# EAGLE schematic 3dofboard (EAGLE 6.5.0)
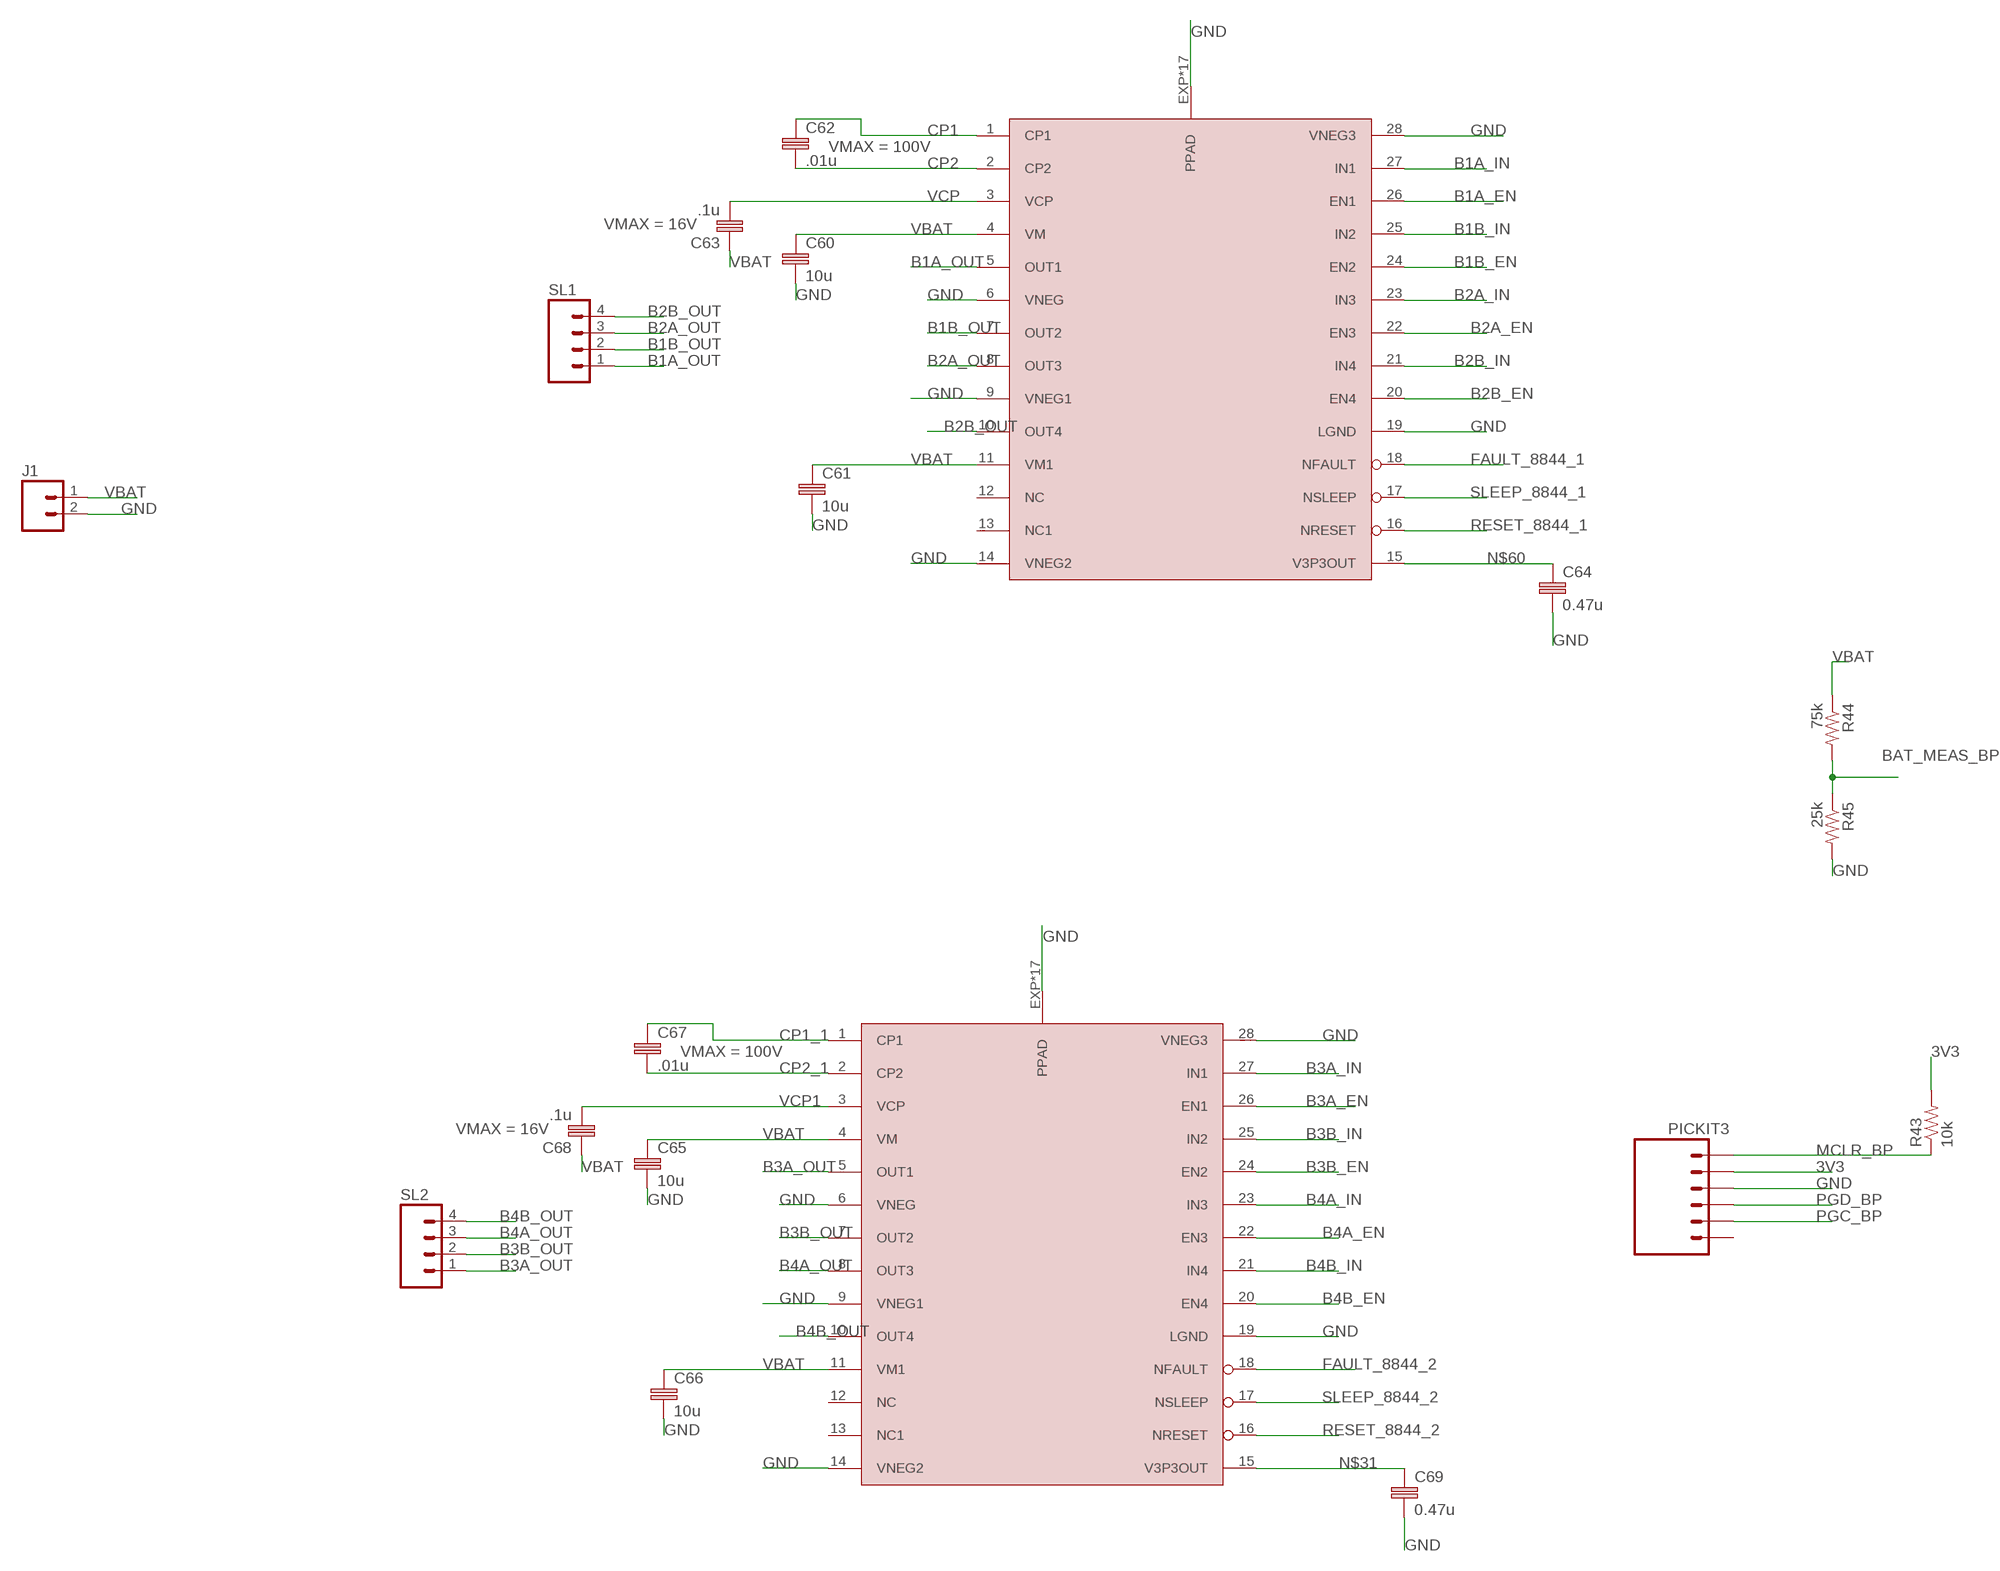
[diagram p0: schematic, sheet 1, part 1 of 3]
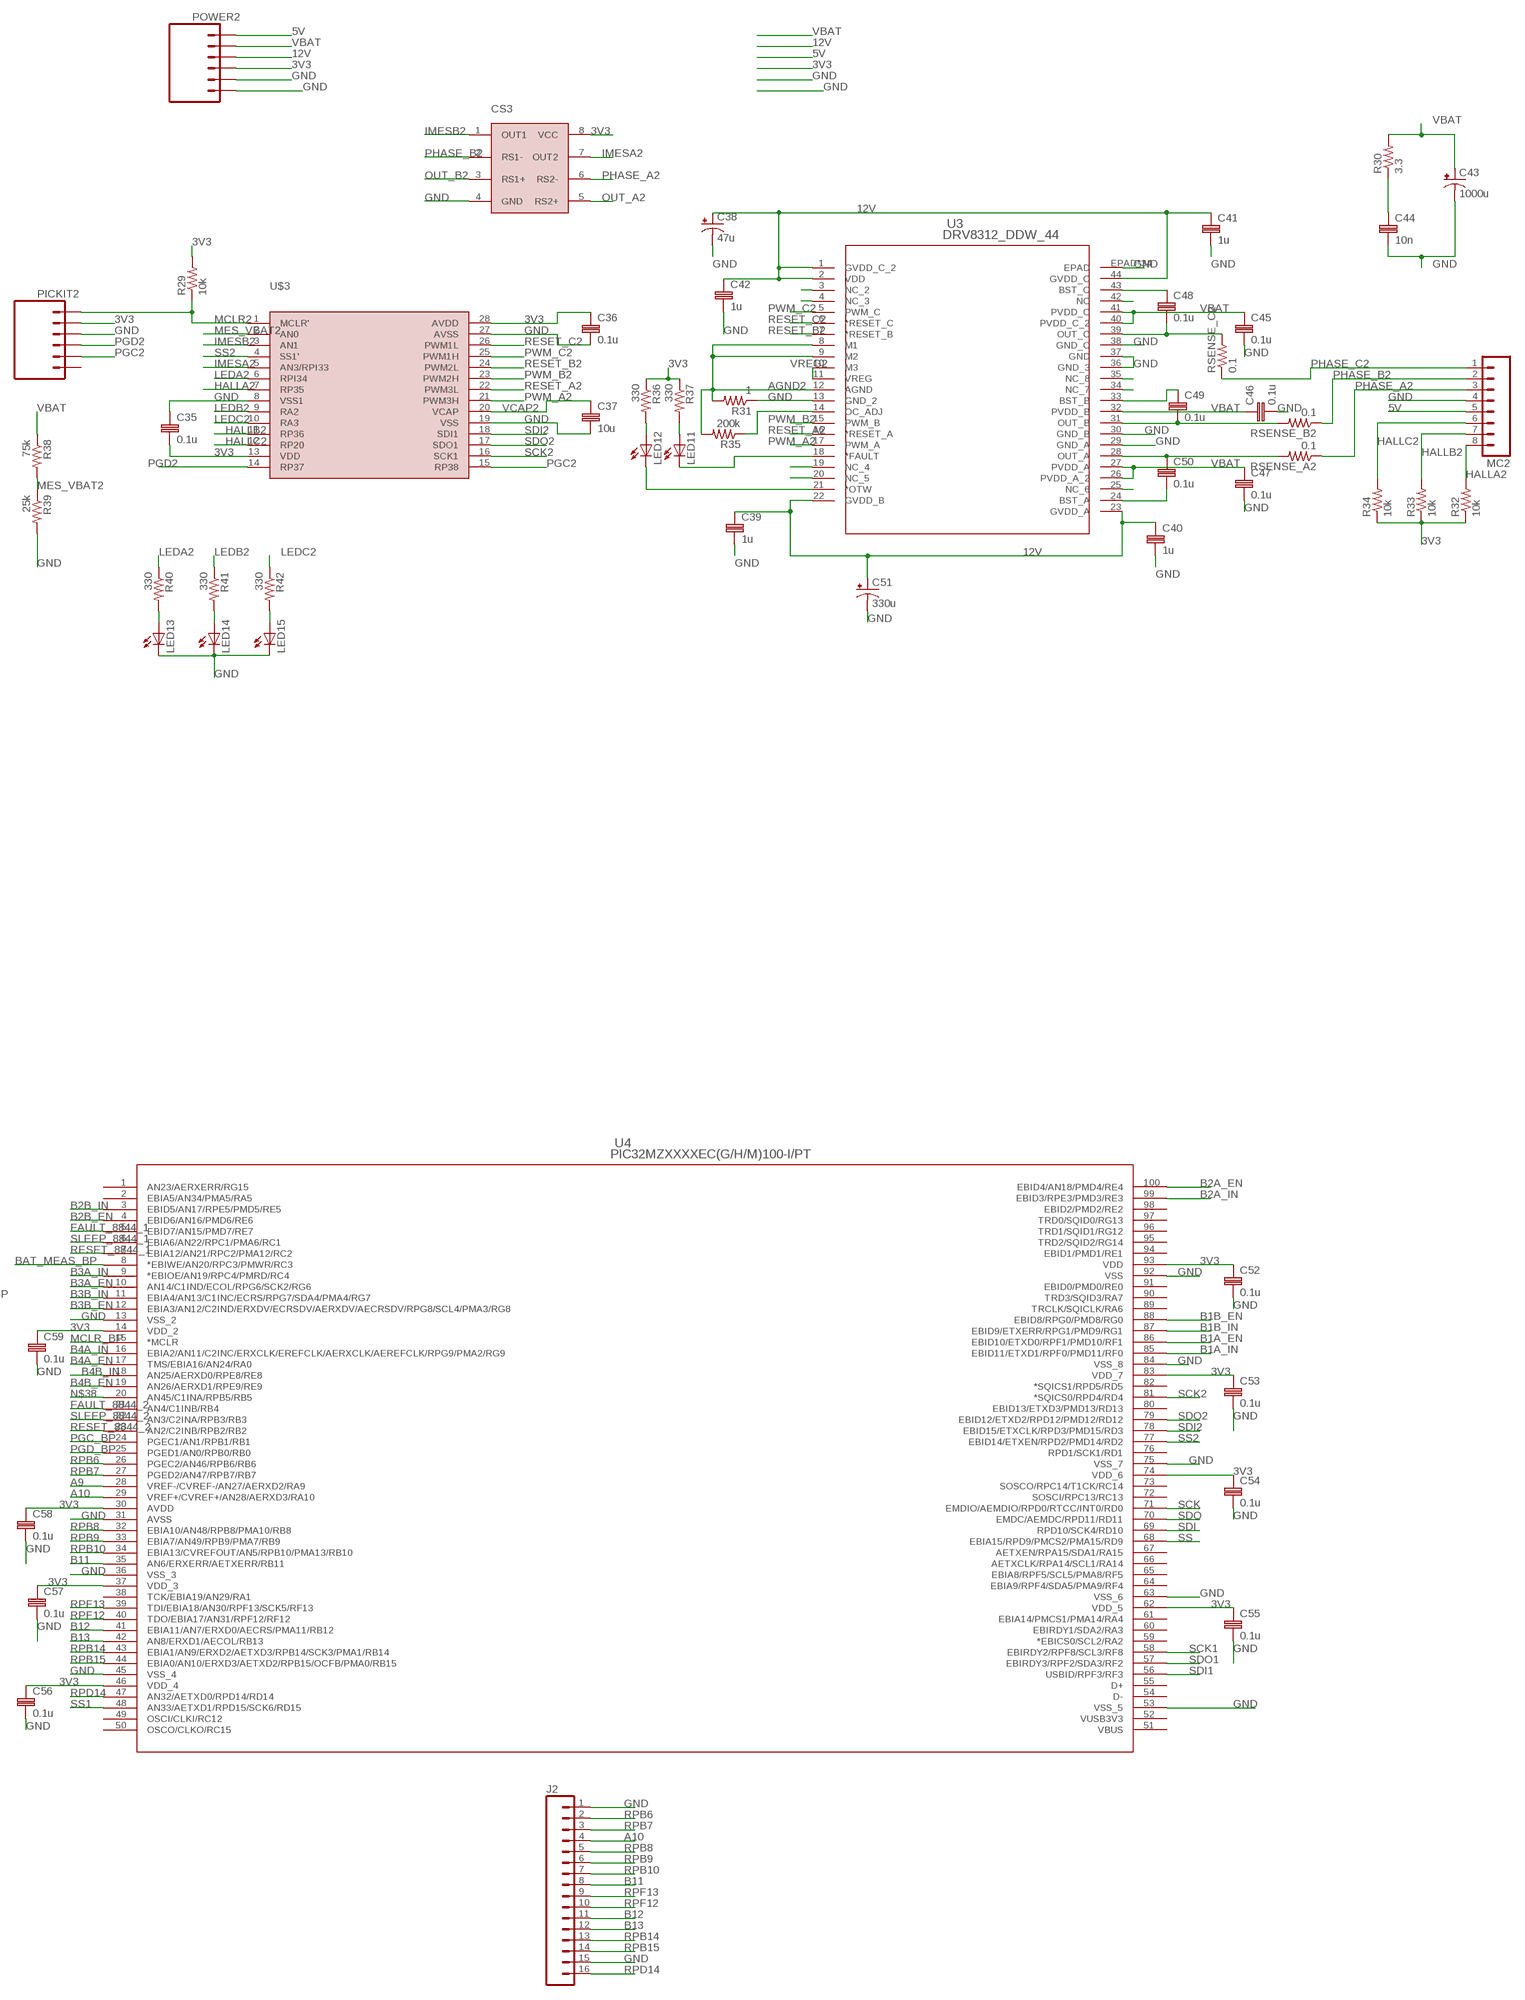
[diagram p1: schematic, sheet 1, part 2 of 3]
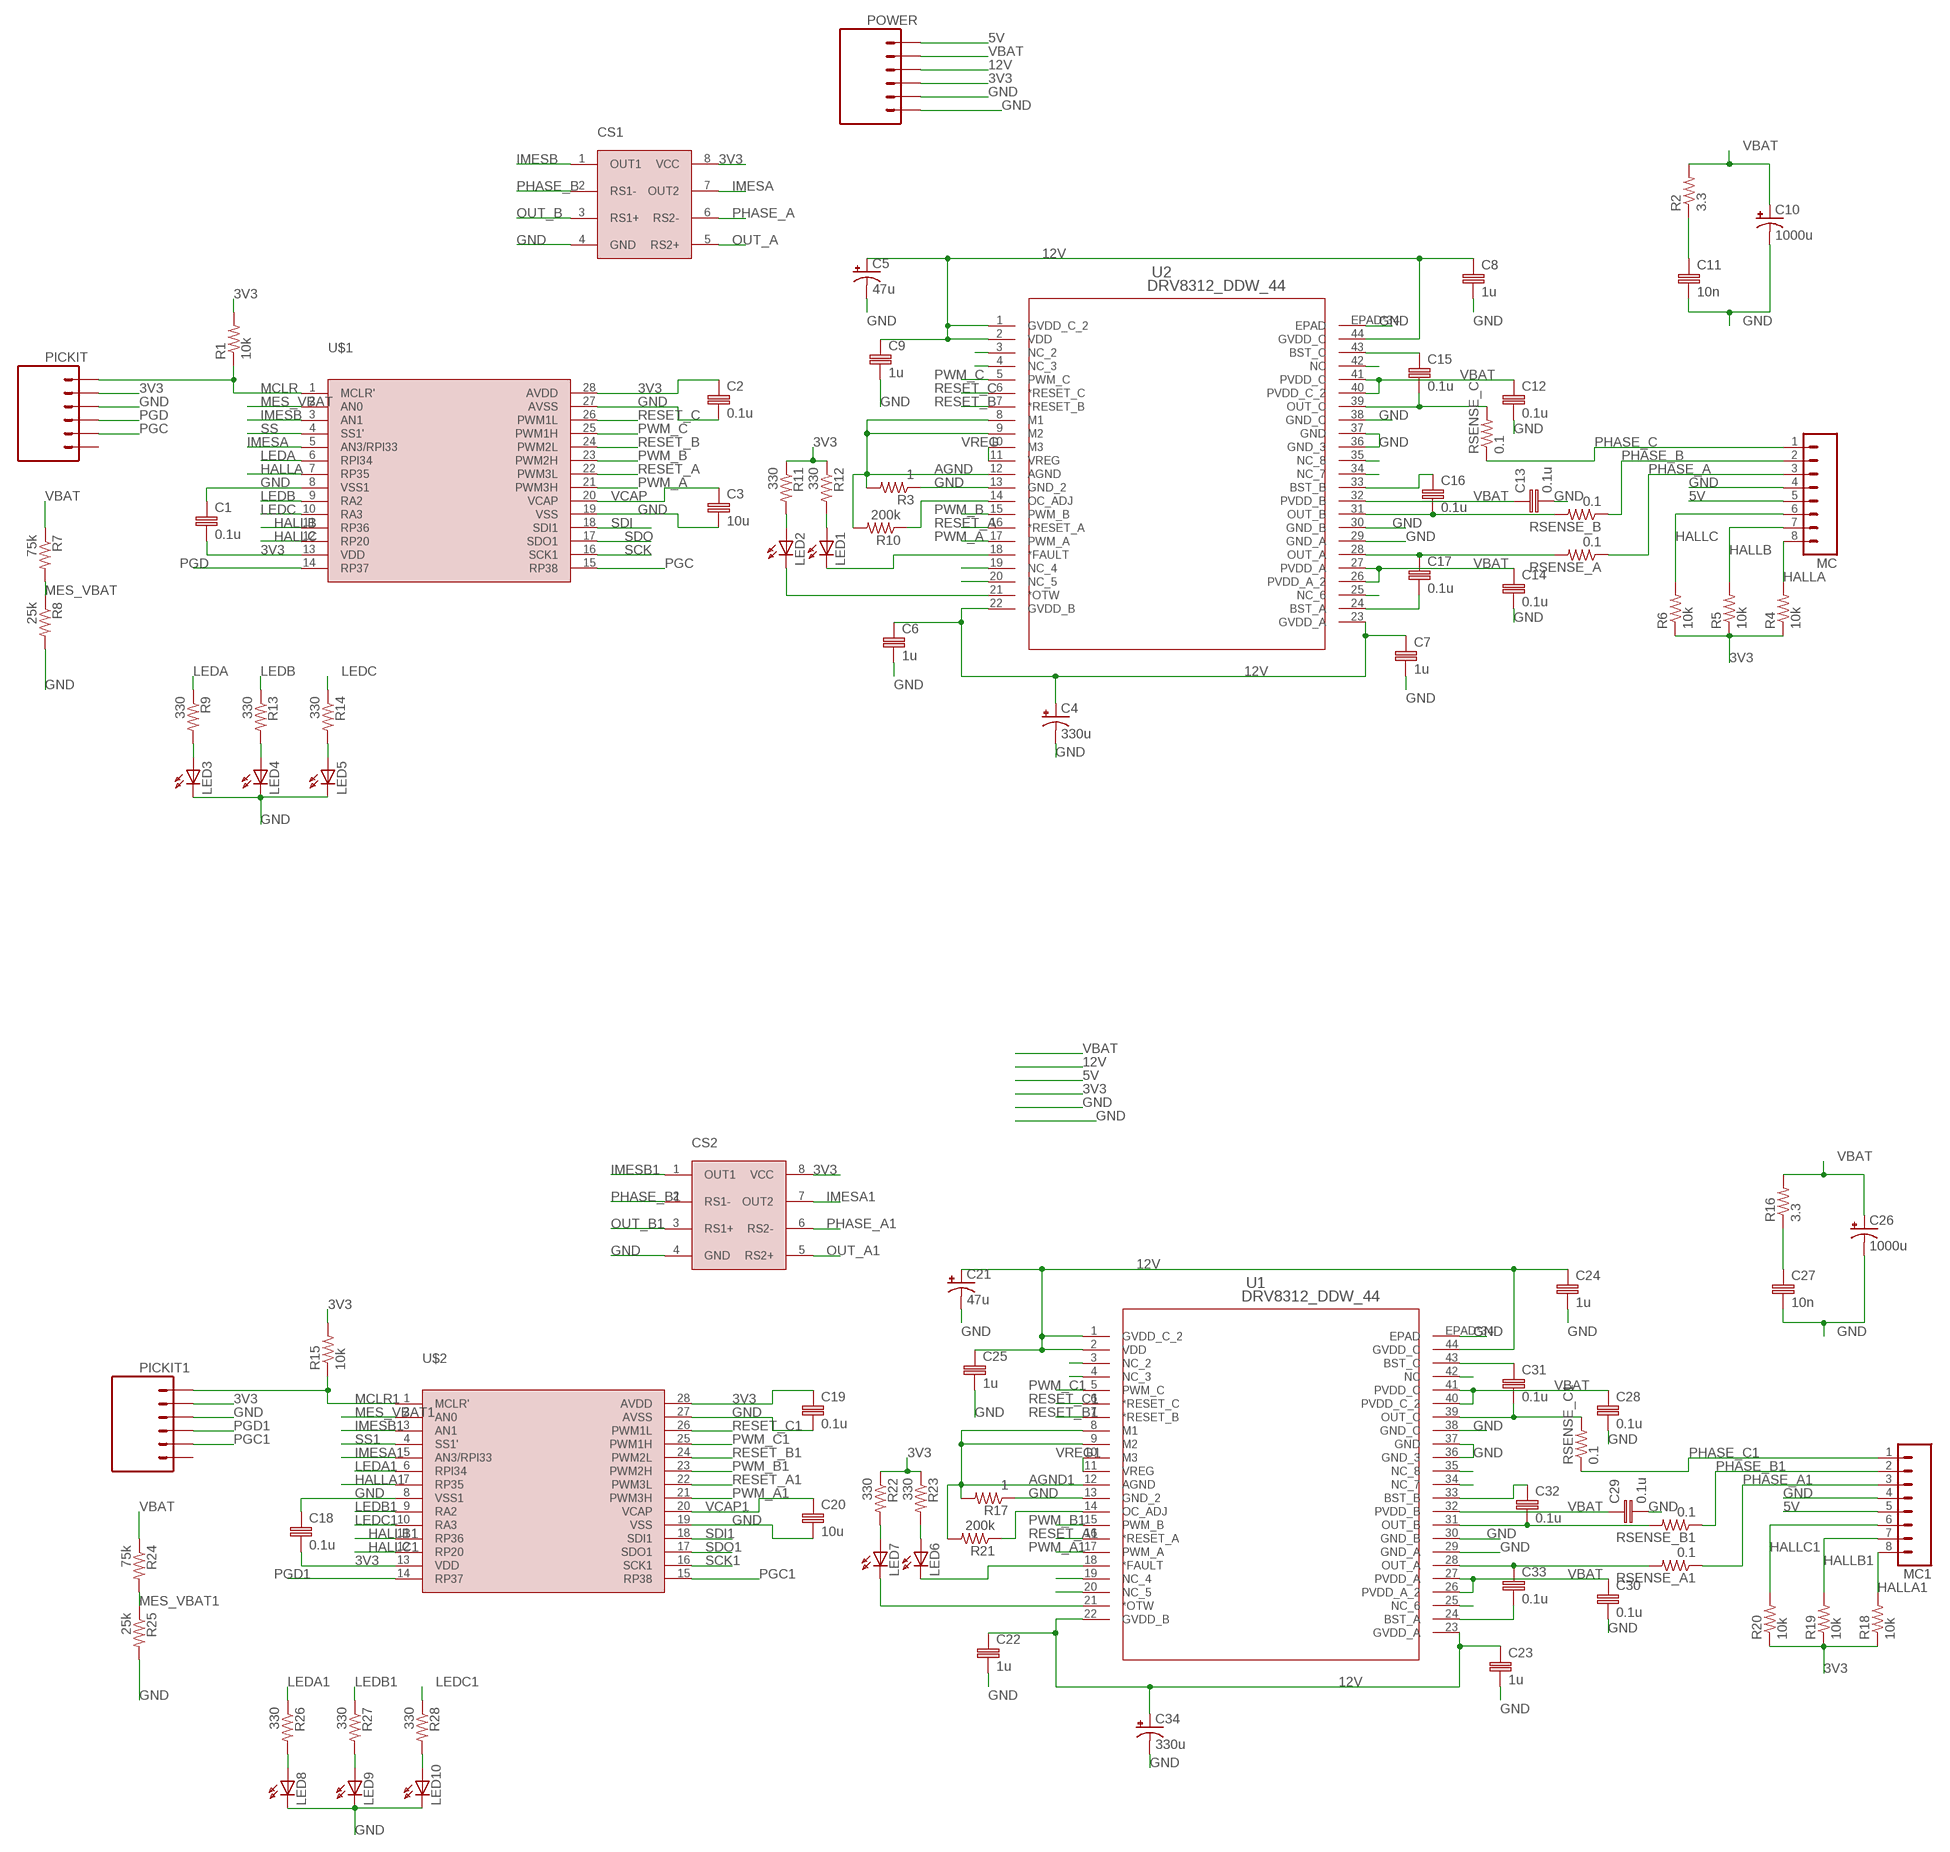
[diagram p2: schematic, sheet 1, part 3 of 3]

## Parts
C1  0.1u  CAP0805  [0805]
C2  0.1u  CAP0805  [0805]
C3  10u  CAP0805  [0805]
C4  330u  CPOL-USE3.5-8  [E3,5-8]
C5  47u  CAP_POLPTH1  [CPOL-RADIAL-100UF-25V]
C6  1u  CAP0805  [0805]
C7  1u  CAP0805  [0805]
C8  1u  CAP0805  [0805]
C9  1u  CAP0805  [0805]
C10  1000u  CAP_POLPTH4  [CPOL-RADIAL-1000UF-25V]
C11  10n  CAP0805  [0805]
C12  0.1u  CAP0805  [0805]
C13  0.1u  CAP0805  [0805]
C14  0.1u  CAP0805  [0805]
C15  0.1u  CAP0805  [0805]
C16  0.1u  CAP0805  [0805]
C17  0.1u  CAP0805  [0805]
C18  0.1u  CAP0805  [0805]
C19  0.1u  CAP0805  [0805]
C20  10u  CAP0805  [0805]
C21  47u  CAP_POLPTH1  [CPOL-RADIAL-100UF-25V]
C22  1u  CAP0805  [0805]
C23  1u  CAP0805  [0805]
C24  1u  CAP0805  [0805]
C25  1u  CAP0805  [0805]
C26  1000u  CAP_POLPTH4  [CPOL-RADIAL-1000UF-25V]
C27  10n  CAP0805  [0805]
C28  0.1u  CAP0805  [0805]
C29  0.1u  CAP0805  [0805]
C30  0.1u  CAP0805  [0805]
C31  0.1u  CAP0805  [0805]
C32  0.1u  CAP0805  [0805]
C33  0.1u  CAP0805  [0805]
C34  330u  CPOL-USE3.5-8  [E3,5-8]
C35  0.1u  CAP0805  [0805]
C36  0.1u  CAP0805  [0805]
C37  10u  CAP0805  [0805]
C38  47u  CAP_POLPTH1  [CPOL-RADIAL-100UF-25V]
C39  1u  CAP0805  [0805]
C40  1u  CAP0805  [0805]
C41  1u  CAP0805  [0805]
C42  1u  CAP0805  [0805]
C43  1000u  CAP_POLPTH4  [CPOL-RADIAL-1000UF-25V]
C44  10n  CAP0805  [0805]
C45  0.1u  CAP0805  [0805]
C46  0.1u  CAP0805  [0805]
C47  0.1u  CAP0805  [0805]
C48  0.1u  CAP0805  [0805]
C49  0.1u  CAP0805  [0805]
C50  0.1u  CAP0805  [0805]
C51  330u  CPOL-USE3.5-8  [E3,5-8]
C52  0.1u  CAP0805  [0805]
C53  0.1u  CAP0805  [0805]
C54  0.1u  CAP0805  [0805]
C55  0.1u  CAP0805  [0805]
C56  0.1u  CAP0805  [0805]
C57  0.1u  CAP0805  [0805]
C58  0.1u  CAP0805  [0805]
C59  0.1u  CAP0805  [0805]
C60  10u  CAP0805  [0805]
C61  10u  CAP0805  [0805]
C62  .01u  CAP0805  [0805]
C63  .1u  CAP0805  [0805]
C64  0.47u  CAP0805  [0805]
C65  10u  CAP0805  [0805]
C66  10u  CAP0805  [0805]
C67  .01u  CAP0805  [0805]
C68  .1u  CAP0805  [0805]
C69  0.47u  CAP0805  [0805]
CS1  MAX4376  [SO8]
CS2  MAX4376  [SO8]
CS3  MAX4376  [SO8]
J1  M02LOCK  [1X02_LOCK]
J2  M16DUAL_ROW  [2X8]
LED1  LED0805  [LED-0805]
LED2  LED0805  [LED-0805]
LED3  LED0805  [LED-0805]
LED4  LED0805  [LED-0805]
LED5  LED0805  [LED-0805]
LED6  LED0805  [LED-0805]
LED7  LED0805  [LED-0805]
LED8  LED0805  [LED-0805]
LED9  LED0805  [LED-0805]
LED10  LED0805  [LED-0805]
LED11  LED0805  [LED-0805]
LED12  LED0805  [LED-0805]
LED13  LED0805  [LED-0805]
LED14  LED0805  [LED-0805]
LED15  LED0805  [LED-0805]
MC  M08  [08P]
MC1  M08  [08P]
MC2  M08  [08P]
PICKIT  M06LOCK  [1X06_LOCK]
PICKIT1  M06LOCK  [1X06_LOCK]
PICKIT2  M06LOCK  [1X06_LOCK]
PICKIT3  M06LOCK  [1X06_LOCK]
POWER  M06LOCK  [1X06_LOCK]
POWER2  M06LOCK  [1X06_LOCK]
R1  10k  RESISTOR0805-RES  [0805]
R2  3.3  RESISTOR0805-RES  [0805]
R3  1  RESISTOR0805-RES  [0805]
R4  10k  RESISTOR0805-RES  [0805]
R5  10k  RESISTOR0805-RES  [0805]
R6  10k  RESISTOR0805-RES  [0805]
R7  75k  RESISTOR0805-RES  [0805]
R8  25k  RESISTOR0805-RES  [0805]
R9  330  RESISTOR0805-RES  [0805]
R10  200k  RESISTOR0805-RES  [0805]
R11  330  RESISTOR0805-RES  [0805]
R12  330  RESISTOR0805-RES  [0805]
R13  330  RESISTOR0805-RES  [0805]
R14  330  RESISTOR0805-RES  [0805]
R15  10k  RESISTOR0805-RES  [0805]
R16  3.3  RESISTOR0805-RES  [0805]
R17  1  RESISTOR0805-RES  [0805]
R18  10k  RESISTOR0805-RES  [0805]
R19  10k  RESISTOR0805-RES  [0805]
R20  10k  RESISTOR0805-RES  [0805]
R21  200k  RESISTOR0805-RES  [0805]
R22  330  RESISTOR0805-RES  [0805]
R23  330  RESISTOR0805-RES  [0805]
R24  75k  RESISTOR0805-RES  [0805]
R25  25k  RESISTOR0805-RES  [0805]
R26  330  RESISTOR0805-RES  [0805]
R27  330  RESISTOR0805-RES  [0805]
R28  330  RESISTOR0805-RES  [0805]
R29  10k  RESISTOR0805-RES  [0805]
R30  3.3  RESISTOR0805-RES  [0805]
R31  1  RESISTOR0805-RES  [0805]
R32  10k  RESISTOR0805-RES  [0805]
R33  10k  RESISTOR0805-RES  [0805]
R34  10k  RESISTOR0805-RES  [0805]
R35  200k  RESISTOR0805-RES  [0805]
R36  330  RESISTOR0805-RES  [0805]
R37  330  RESISTOR0805-RES  [0805]
R38  75k  RESISTOR0805-RES  [0805]
R39  25k  RESISTOR0805-RES  [0805]
R40  330  RESISTOR0805-RES  [0805]
R41  330  RESISTOR0805-RES  [0805]
R42  330  RESISTOR0805-RES  [0805]
R43  10k  RESISTOR0805-RES  [0805]
R44  75k  RESISTOR0805-RES  [0805]
R45  25k  RESISTOR0805-RES  [0805]
RSENSE_A  0.1  RESISTOR0805-RES  [0805]
RSENSE_A1  0.1  RESISTOR0805-RES  [0805]
RSENSE_A2  0.1  RESISTOR0805-RES  [0805]
RSENSE_B  0.1  RESISTOR0805-RES  [0805]
RSENSE_B1  0.1  RESISTOR0805-RES  [0805]
RSENSE_B2  0.1  RESISTOR0805-RES  [0805]
RSENSE_C  0.1  RESISTOR0805-RES  [0805]
RSENSE_C1  0.1  RESISTOR0805-RES  [0805]
RSENSE_C2  0.1  RESISTOR0805-RES  [0805]
SL1  M04LOCK  [1X04_LOCK]
SL2  M04LOCK  [1X04_LOCK]
U1  DRV8312_DDW_44  [DDW44_8P26X4P31]
U2  DRV8312_DDW_44  [DDW44_8P26X4P31]
U3  DRV8312_DDW_44  [DDW44_8P26X4P31]
U4  PIC32MZXXXXEC(G/H/M)100-I/PT  [TQFP100_12X12MC]
U$1  DSPIC33EP512MC502-28SSOP  [SSOP28]
U$2  DSPIC33EP512MC502-28SSOP  [SSOP28]
U$3  DSPIC33EP512MC502-28SSOP  [SSOP28]
U$4  DRV8844PWP  [TSSOP-28]
U$5  DRV8844PWP  [TSSOP-28]

## Nets
3V3: C1.2 C2.1 C18.2 C19.1 C35.2 C36.1 C52.1 C53.1 C54.1 C55.1 C56.1 C57.1 C58.1 C59.1 CS1.8(VCC) CS2.8(VCC) CS3.8(VCC) PICKIT1.2 PICKIT2.2 PICKIT3.2 PICKIT.2 POWER2.4 POWER.4 R1.2 R4.1 R5.1 R6.1 R11.1 R12.1 R15.2 R18.1 R19.1 R20.1 R22.1 R23.1 R29.2 R32.1 R33.1 R34.1 R36.1 R37.1 R43.2 U4.14(VDD_2) U4.30(AVDD) U4.37(VDD_3) U4.46(VDD_4) U4.62(VDD_5) U4.74(VDD_6) U4.83(VDD_7) U4.93(VDD) U$1.13(VDD) U$1.28(AVDD) U$2.13(VDD) U$2.28(AVDD) U$3.13(VDD) U$3.28(AVDD)
5V: MC1.5 MC2.5 MC.5 POWER2.1 POWER.1
12V: C4.+ C5.1(+) C6.1 C7.1 C8.1 C9.1 C21.1(+) C22.1 C23.1 C24.1 C25.1 C34.+ C38.1(+) C39.1 C40.1 C41.1 C42.1 C51.+ POWER2.3 POWER.3 U1.1(GVDD_C_2) U1.2(VDD) U1.22(GVDD_B) U1.23(GVDD_A) U1.44(GVDD_C) U2.1(GVDD_C_2) U2.2(VDD) U2.22(GVDD_B) U2.23(GVDD_A) U2.44(GVDD_C) U3.1(GVDD_C_2) U3.2(VDD) U3.22(GVDD_B) U3.23(GVDD_A) U3.44(GVDD_C)
A9: U4.28(VREF-/CVREF-/AN27/AERXD2/RA9)
A10: J2.4 U4.29(VREF+/CVREF+/AN28/AERXD3/RA10)
AGND: R3.2 R10.2 U2.8(M1) U2.9(M2) U2.12(AGND)
AGND1: R17.2 R21.2 U1.8(M1) U1.9(M2) U1.12(AGND)
AGND2: R31.2 R35.2 U3.8(M1) U3.9(M2) U3.12(AGND)
B1A_EN: U4.86(EBID10/ETXD0/RPF1/PMD10/RF1) U$4.26(EN1)
B1A_IN: U4.85(EBID11/ETXD1/RPF0/PMD11/RF0) U$4.27(IN1)
B1A_OUT: SL1.1 U$4.5(OUT1)
B1B_EN: U4.88(EBID8/RPG0/PMD8/RG0) U$4.24(EN2)
B1B_IN: U4.87(EBID9/ETXERR/RPG1/PMD9/RG1) U$4.25(IN2)
B1B_OUT: SL1.2 U$4.7(OUT2)
B2A_EN: U4.100(EBID4/AN18/PMD4/RE4) U$4.22(EN3)
B2A_IN: U4.99(EBID3/RPE3/PMD3/RE3) U$4.23(IN3)
B2A_OUT: SL1.3 U$4.8(OUT3)
B2B_EN: U4.4(EBID6/AN16/PMD6/RE6) U$4.20(EN4)
B2B_IN: U4.3(EBID5/AN17/RPE5/PMD5/RE5) U$4.21(IN4)
B2B_OUT: SL1.4 U$4.10(OUT4)
B3A_EN: U4.10(AN14/C1IND/ECOL/RPG6/SCK2/RG6) U$5.26(EN1)
B3A_IN: U4.9(*EBIOE/AN19/RPC4/PMRD/RC4) U$5.27(IN1)
B3A_OUT: SL2.1 U$5.5(OUT1)
B3B_EN: U4.12(EBIA3/AN12/C2IND/ERXDV/ECRSDV/AERXDV/AECRSDV/RPG8/SCL4/PMA3/RG8) U$5.24(EN2)
B3B_IN: U4.11(EBIA4/AN13/C1INC/ECRS/RPG7/SDA4/PMA4/RG7) U$5.25(IN2)
B3B_OUT: SL2.2 U$5.7(OUT2)
B4A_EN: U4.17(TMS/EBIA16/AN24/RA0) U$5.22(EN3)
B4A_IN: U4.16(EBIA2/AN11/C2INC/ERXCLK/EREFCLK/AERXCLK/AEREFCLK/RPG9/PMA2/RG9) U$5.23(IN3)
B4A_OUT: SL2.3 U$5.8(OUT3)
B4B_EN: U4.19(AN26/AERXD1/RPE9/RE9) U$5.20(EN4)
B4B_IN: U4.18(AN25/AERXD0/RPE8/RE8) U$5.21(IN4)
B4B_OUT: SL2.4 U$5.10(OUT4)
B11: J2.8 U4.35(AN6/ERXERR/AETXERR/RB11)
B12: J2.11 U4.41(EBIA11/AN7/ERXD0/AECRS/PMA11/RB12)
B13: J2.12 U4.42(AN8/ERXD1/AECOL/RB13)
BAT_MEAS_BP: R44.2 R45.1 U4.8(*EBIWE/AN20/RPC3/PMWR/RC3)
CP1: C62.1 U$4.1(CP1)
CP1_1: C67.1 U$5.1(CP1)
CP2: C62.2 U$4.2(CP2)
CP2_1: C67.2 U$5.2(CP2)
FAULT': LED1.2(C) U2.18(*FAULT)
FAULT'1: LED6.2(C) U1.18(*FAULT)
FAULT'2: LED11.2(C) U3.18(*FAULT)
FAULT_8844_1: U4.5(EBID7/AN15/PMD7/RE7) U$4.18(NFAULT)
FAULT_8844_2: U4.21(AN4/C1INB/RB4) U$5.18(NFAULT)
GND: C1.1 C2.2 C3.2 C4.- C5.2(-) C6.2 C7.2 C8.2 C9.2 C10.2(-) C11.2 C12.2 C13.2 C14.2 C18.1 C19.2 C20.2 C21.2(-) C22.2 C23.2 C24.2 C25.2 C26.2(-) C27.2 C28.2 C29.2 C30.2 C34.- C35.1 C36.2 C37.2 C38.2(-) C39.2 C40.2 C41.2 C42.2 C43.2(-) C44.2 C45.2 C46.2 C47.2 C51.- C52.2 C53.2 C54.2 C55.2 C56.2 C57.2 C58.2 C59.2 C60.2 C61.2 C64.2 C65.2 C66.2 C69.2 CS1.4(GND) CS2.4(GND) CS3.4(GND) J1.2 J2.1 J2.15 LED3.2(C) LED4.2(C) LED5.2(C) LED8.2(C) LED9.2(C) LED10.2(C) LED13.2(C) LED14.2(C) LED15.2(C) MC1.4 MC2.4 MC.4 PICKIT1.3 PICKIT2.3 PICKIT3.3 PICKIT.3 POWER2.5 POWER2.6 POWER.5 POWER.6 R3.1 R8.2 R17.1 R25.2 R31.1 R39.2 R45.2 U1.3(NC_2) U1.4(NC_3) U1.13(GND_2) U1.19(NC_4) U1.20(NC_5) U1.25(NC_6) U1.29(GND_A) U1.30(GND_B) U1.34(NC_7) U1.35(NC_8) U1.36(GND_3) U1.37(GND) U1.38(GND_C) U1.42(NC) U1.EPAD U1.P$1(EPAD) U1.P$2(EPAD) U1.P$3(EPAD) U1.P$4(EPAD) U1.P$5(EPAD) U1.P$6(EPAD) U1.P$7(EPAD) U1.P$8(EPAD) U1.P$9(EPAD) U1.P$10(EPAD) U1.P$11(EPAD) U1.P$12(EPAD) U1.P$13(EPAD) U1.P$14(EPAD) U1.P$15(EPAD) U1.P$16(EPAD) U1.P$17(EPAD) U1.P$18(EPAD) U1.P$19(EPAD) U1.P$20(EPAD) U1.P$21(EPAD) U1.P$22(EPAD) U1.P$23(EPAD) U1.P$24(EPAD) U1.P$25(EPAD) U1.P$26(EPAD) U1.P$27(EPAD) U1.P$28(EPAD) U1.P$29(EPAD) U1.P$30(EPAD) U1.P$31(EPAD) U1.P$32(EPAD) U1.P$33(EPAD) U2.3(NC_2) U2.4(NC_3) U2.13(GND_2) U2.19(NC_4) U2.20(NC_5) U2.25(NC_6) U2.29(GND_A) U2.30(GND_B) U2.34(NC_7) U2.35(NC_8) U2.36(GND_3) U2.37(GND) U2.38(GND_C) U2.42(NC) U2.EPAD U2.P$1(EPAD) U2.P$2(EPAD) U2.P$3(EPAD) U2.P$4(EPAD) U2.P$5(EPAD) U2.P$6(EPAD) U2.P$7(EPAD) U2.P$8(EPAD) U2.P$9(EPAD) U2.P$10(EPAD) U2.P$11(EPAD) U2.P$12(EPAD) U2.P$13(EPAD) U2.P$14(EPAD) U2.P$15(EPAD) U2.P$16(EPAD) U2.P$17(EPAD) U2.P$18(EPAD) U2.P$19(EPAD) U2.P$20(EPAD) U2.P$21(EPAD) U2.P$22(EPAD) U2.P$23(EPAD) U2.P$24(EPAD) U2.P$25(EPAD) U2.P$26(EPAD) U2.P$27(EPAD) U2.P$28(EPAD) U2.P$29(EPAD) U2.P$30(EPAD) U2.P$31(EPAD) U2.P$32(EPAD) U2.P$33(EPAD) U3.3(NC_2) U3.4(NC_3) U3.13(GND_2) U3.19(NC_4) U3.20(NC_5) U3.25(NC_6) U3.29(GND_A) U3.30(GND_B) U3.34(NC_7) U3.35(NC_8) U3.36(GND_3) U3.37(GND) U3.38(GND_C) U3.42(NC) U3.EPAD U3.P$1(EPAD) U3.P$2(EPAD) U3.P$3(EPAD) U3.P$4(EPAD) U3.P$5(EPAD) U3.P$6(EPAD) U3.P$7(EPAD) U3.P$8(EPAD) U3.P$9(EPAD) U3.P$10(EPAD) U3.P$11(EPAD) U3.P$12(EPAD) U3.P$13(EPAD) U3.P$14(EPAD) U3.P$15(EPAD) U3.P$16(EPAD) U3.P$17(EPAD) U3.P$18(EPAD) U3.P$19(EPAD) U3.P$20(EPAD) U3.P$21(EPAD) U3.P$22(EPAD) U3.P$23(EPAD) U3.P$24(EPAD) U3.P$25(EPAD) U3.P$26(EPAD) U3.P$27(EPAD) U3.P$28(EPAD) U3.P$29(EPAD) U3.P$30(EPAD) U3.P$31(EPAD) U3.P$32(EPAD) U3.P$33(EPAD) U4.13(VSS_2) U4.31(AVSS) U4.36(VSS_3) U4.45(VSS_4) U4.53(VSS_5) U4.63(VSS_6) U4.75(VSS_7) U4.84(VSS_8) U4.92(VSS) U$1.8(VSS1) U$1.19(VSS) U$1.27(AVSS) U$2.8(VSS1) U$2.19(VSS) U$2.27(AVSS) U$3.8(VSS1) U$3.19(VSS) U$3.27(AVSS) U$4.6(VNEG) U$4.9(VNEG1) U$4.14(VNEG2) U$4.19(LGND) U$4.28(VNEG3) U$4.EXP(PPAD) U$4.P$1(PPAD) U$4.P$2(PPAD) U$4.P$3(PPAD) U$4.P$4(PPAD) U$4.P$5(PPAD) U$4.P$6(PPAD) U$4.P$7(PPAD) U$4.P$8(PPAD) U$4.P$9(PPAD) U$4.P$10(PPAD) U$4.P$11(PPAD) U$4.P$12(PPAD) U$4.P$13(PPAD) U$4.P$14(PPAD) U$4.P$15(PPAD) U$4.P$16(PPAD) U$5.6(VNEG) U$5.9(VNEG1) U$5.14(VNEG2) U$5.19(LGND) U$5.28(VNEG3) U$5.EXP(PPAD) U$5.P$1(PPAD) U$5.P$2(PPAD) U$5.P$3(PPAD) U$5.P$4(PPAD) U$5.P$5(PPAD) U$5.P$6(PPAD) U$5.P$7(PPAD) U$5.P$8(PPAD) U$5.P$9(PPAD) U$5.P$10(PPAD) U$5.P$11(PPAD) U$5.P$12(PPAD) U$5.P$13(PPAD) U$5.P$14(PPAD) U$5.P$15(PPAD) U$5.P$16(PPAD)
HALLA: MC.8 R4.2 U$1.7(RP35)
HALLA1: MC1.8 R18.2 U$2.7(RP35)
HALLA2: MC2.8 R32.2 U$3.7(RP35)
HALLB: MC.7 R5.2 U$1.11(RP36)
HALLB1: MC1.7 R19.2 U$2.11(RP36)
HALLB2: MC2.7 R33.2 U$3.11(RP36)
HALLC: MC.6 R6.2 U$1.12(RP20)
HALLC1: MC1.6 R20.2 U$2.12(RP20)
HALLC2: MC2.6 R34.2 U$3.12(RP20)
IMESA: CS1.7(OUT2) U$1.5(AN3/RPI33)
IMESA1: CS2.7(OUT2) U$2.5(AN3/RPI33)
IMESA2: CS3.7(OUT2) U$3.5(AN3/RPI33)
IMESB: CS1.1(OUT1) U$1.3(AN1)
IMESB1: CS2.1(OUT1) U$2.3(AN1)
IMESB2: CS3.1(OUT1) U$3.3(AN1)
LEDA: R9.1 U$1.6(RPI34)
LEDA1: R26.1 U$2.6(RPI34)
LEDA2: R40.1 U$3.6(RPI34)
LEDB: R13.1 U$1.9(RA2)
LEDB1: R27.1 U$2.9(RA2)
LEDB2: R41.1 U$3.9(RA2)
LEDC: R14.1 U$1.10(RA3)
LEDC1: R28.1 U$2.10(RA3)
LEDC2: R42.1 U$3.10(RA3)
MCLR: PICKIT.1 R1.1 U$1.1(MCLR')
MCLR1: PICKIT1.1 R15.1 U$2.1(MCLR')
MCLR2: PICKIT2.1 R29.1 U$3.1(MCLR')
MCLR_BP: PICKIT3.1 R43.1 U4.15(*MCLR)
MES_VBAT: R7.2 R8.1 U$1.2(AN0)
MES_VBAT1: R24.2 R25.1 U$2.2(AN0)
MES_VBAT2: R38.2 R39.1 U$3.2(AN0)
N$1: C11.1 R2.1
N$2: LED3.1(A) R9.2
N$3: LED4.1(A) R13.2
N$4: R10.1 U2.14(OC_ADJ)
N$5: C17.2 U2.24(BST_A)
N$6: LED1.1(A) R12.2
N$7: C16.1 U2.33(BST_B)
N$8: C15.1 U2.43(BST_C)
N$9: LED2.1(A) R11.2
N$10: LED5.1(A) R14.2
N$11: C27.1 R16.1
N$12: C33.2 U1.24(BST_A)
N$13: C32.1 U1.33(BST_B)
N$14: C31.1 U1.43(BST_C)
N$15: R21.1 U1.14(OC_ADJ)
N$16: LED6.1(A) R23.2
N$17: LED7.1(A) R22.2
N$18: LED8.1(A) R26.2
N$19: LED9.1(A) R27.2
N$20: LED10.1(A) R28.2
N$21: C44.1 R30.1
N$22: C50.2 U3.24(BST_A)
N$23: C49.1 U3.33(BST_B)
N$24: C48.1 U3.43(BST_C)
N$25: R35.1 U3.14(OC_ADJ)
N$26: LED11.1(A) R37.2
N$27: LED12.1(A) R36.2
N$28: LED13.1(A) R40.2
N$29: LED14.1(A) R41.2
N$30: LED15.1(A) R42.2
N$31: C69.1 U$5.15(V3P3OUT)
N$38: U4.20(AN45/C1INA/RPB5/RB5)
N$60: C64.1 U$4.15(V3P3OUT)
OTW': LED2.2(C) U2.21(*OTW)
OTW'1: LED7.2(C) U1.21(*OTW)
OTW'2: LED12.2(C) U3.21(*OTW)
OUT_A: C17.1 CS1.5(RS2+) RSENSE_A.2 U2.28(OUT_A)
OUT_A1: C33.1 CS2.5(RS2+) RSENSE_A1.2 U1.28(OUT_A)
OUT_A2: C50.1 CS3.5(RS2+) RSENSE_A2.2 U3.28(OUT_A)
OUT_B: C16.2 CS1.3(RS1+) RSENSE_B.2 U2.31(OUT_B)
OUT_B1: C32.2 CS2.3(RS1+) RSENSE_B1.2 U1.31(OUT_B)
OUT_B2: C49.2 CS3.3(RS1+) RSENSE_B2.2 U3.31(OUT_B)
OUT_C: C15.2 RSENSE_C.2 U2.39(OUT_C)
OUT_C1: C31.2 RSENSE_C1.2 U1.39(OUT_C)
OUT_C2: C48.2 RSENSE_C2.2 U3.39(OUT_C)
PGC: PICKIT.5 U$1.15(RP38)
PGC1: PICKIT1.5 U$2.15(RP38)
PGC2: PICKIT2.5 U$3.15(RP38)
PGC_BP: PICKIT3.5 U4.24(PGEC1/AN1/RPB1/RB1)
PGD: PICKIT.4 U$1.14(RP37)
PGD1: PICKIT1.4 U$2.14(RP37)
PGD2: PICKIT2.4 U$3.14(RP37)
PGD_BP: PICKIT3.4 U4.25(PGED1/AN0/RPB0/RB0)
PHASE_A: CS1.6(RS2-) MC.3 RSENSE_A.1
PHASE_A1: CS2.6(RS2-) MC1.3 RSENSE_A1.1
PHASE_A2: CS3.6(RS2-) MC2.3 RSENSE_A2.1
PHASE_B: CS1.2(RS1-) MC.2 RSENSE_B.1
PHASE_B1: CS2.2(RS1-) MC1.2 RSENSE_B1.1
PHASE_B2: CS3.2(RS1-) MC2.2 RSENSE_B2.1
PHASE_C: MC.1 RSENSE_C.1
PHASE_C1: MC1.1 RSENSE_C1.1
PHASE_C2: MC2.1 RSENSE_C2.1
PWM_A: U2.17(PWM_A) U$1.21(PWM3H)
PWM_A1: U1.17(PWM_A) U$2.21(PWM3H)
PWM_A2: U3.17(PWM_A) U$3.21(PWM3H)
PWM_B: U2.15(PWM_B) U$1.23(PWM2H)
PWM_B1: U1.15(PWM_B) U$2.23(PWM2H)
PWM_B2: U3.15(PWM_B) U$3.23(PWM2H)
PWM_C: U2.5(PWM_C) U$1.25(PWM1H)
PWM_C1: U1.5(PWM_C) U$2.25(PWM1H)
PWM_C2: U3.5(PWM_C) U$3.25(PWM1H)
RESET_8844_1: U4.7(EBIA12/AN21/RPC2/PMA12/RC2) U$4.16(NRESET)
RESET_8844_2: U4.23(AN2/C2INB/RPB2/RB2) U$5.16(NRESET)
RESET_A: U2.16(*RESET_A) U$1.22(PWM3L)
RESET_A1: U1.16(*RESET_A) U$2.22(PWM3L)
RESET_A2: U3.16(*RESET_A) U$3.22(PWM3L)
RESET_B: U2.7(*RESET_B) U$1.24(PWM2L)
RESET_B1: U1.7(*RESET_B) U$2.24(PWM2L)
RESET_B2: U3.7(*RESET_B) U$3.24(PWM2L)
RESET_C: U2.6(*RESET_C) U$1.26(PWM1L)
RESET_C1: U1.6(*RESET_C) U$2.26(PWM1L)
RESET_C2: U3.6(*RESET_C) U$3.26(PWM1L)
RPB6: J2.2 U4.26(PGEC2/AN46/RPB6/RB6)
RPB7: J2.3 U4.27(PGED2/AN47/RPB7/RB7)
RPB8: J2.5 U4.32(EBIA10/AN48/RPB8/PMA10/RB8)
RPB9: J2.6 U4.33(EBIA7/AN49/RPB9/PMA7/RB9)
RPB10: J2.7 U4.34(EBIA13/CVREFOUT/AN5/RPB10/PMA13/RB10)
RPB14: J2.13 U4.43(EBIA1/AN9/ERXD2/AETXD3/RPB14/SCK3/PMA1/RB14)
RPB15: J2.14 U4.44(EBIA0/AN10/ERXD3/AETXD2/RPB15/OCFB/PMA0/RB15)
RPD14: J2.16 U4.47(AN32/AETXD0/RPD14/RD14)
RPF12: J2.10 U4.40(TDO/EBIA17/AN31/RPF12/RF12)
RPF13: J2.9 U4.39(TDI/EBIA18/AN30/RPF13/SCK5/RF13)
SCK: U4.71(EMDIO/AEMDIO/RPD0/RTCC/INT0/RD0) U$1.16(SCK1)
SCK1: U4.58(EBIRDY2/RPF8/SCL3/RF8) U$2.16(SCK1)
SCK2: U4.81(*SQICS0/RPD4/RD4) U$3.16(SCK1)
SDI: U4.69(RPD10/SCK4/RD10) U$1.18(SDI1)
SDI1: U4.56(USBID/RPF3/RF3) U$2.18(SDI1)
SDI2: U4.78(EBID15/ETXCLK/RPD3/PMD15/RD3) U$3.18(SDI1)
SDO: U4.70(EMDC/AEMDC/RPD11/RD11) U$1.17(SDO1)
SDO1: U4.57(EBIRDY3/RPF2/SDA3/RF2) U$2.17(SDO1)
SDO2: U4.79(EBID12/ETXD2/RPD12/PMD12/RD12) U$3.17(SDO1)
SLEEP_8844_1: U4.6(EBIA6/AN22/RPC1/PMA6/RC1) U$4.17(NSLEEP)
SLEEP_8844_2: U4.22(AN3/C2INA/RPB3/RB3) U$5.17(NSLEEP)
SS: U4.68(EBIA15/RPD9/PMCS2/PMA15/RD9) U$1.4(SS1')
SS1: U4.48(AN33/AETXD1/RPD15/SCK6/RD15) U$2.4(SS1')
SS2: U4.77(EBID14/ETXEN/RPD2/PMD14/RD2) U$3.4(SS1')
VBAT: C10.1(+) C12.1 C13.1 C14.1 C26.1(+) C28.1 C29.1 C30.1 C43.1(+) C45.1 C46.1 C47.1 C60.1 C61.1 C63.1 C65.1 C66.1 C68.1 J1.1 POWER2.2 POWER.2 R2.2 R7.1 R16.2 R24.1 R30.2 R38.1 R44.1 U1.26(PVDD_A_2) U1.27(PVDD_A) U1.32(PVDD_B) U1.40(PVDD_C_2) U1.41(PVDD_C) U2.26(PVDD_A_2) U2.27(PVDD_A) U2.32(PVDD_B) U2.40(PVDD_C_2) U2.41(PVDD_C) U3.26(PVDD_A_2) U3.27(PVDD_A) U3.32(PVDD_B) U3.40(PVDD_C_2) U3.41(PVDD_C) U$4.4(VM) U$4.11(VM1) U$5.4(VM) U$5.11(VM1)
VCAP: C3.1 U$1.20(VCAP)
VCAP1: C20.1 U$2.20(VCAP)
VCAP2: C37.1 U$3.20(VCAP)
VCP: C63.2 U$4.3(VCP)
VCP1: C68.2 U$5.3(VCP)
VREG: U2.10(M3) U2.11(VREG)
VREG1: U1.10(M3) U1.11(VREG)
VREG2: U3.10(M3) U3.11(VREG)
Unconnected: PICKIT1.6 PICKIT2.6 PICKIT3.6 PICKIT.6 U4.1(AN23/AERXERR/RG15) U4.2(EBIA5/AN34/PMA5/RA5) U4.38(TCK/EBIA19/AN29/RA1) U4.49(OSCI/CLKI/RC12) U4.50(OSCO/CLKO/RC15) U4.54(D-) U4.55(D+) U4.59(*EBICS0/SCL2/RA2) U4.60(EBIRDY1/SDA2/RA3) U4.61(EBIA14/PMCS1/PMA14/RA4) U4.64(EBIA9/RPF4/SDA5/PMA9/RF4) U4.65(EBIA8/RPF5/SCL5/PMA8/RF5) U4.66(AETXCLK/RPA14/SCL1/RA14) U4.67(AETXEN/RPA15/SDA1/RA15) U4.72(SOSCI/RPC13/RC13) U4.73(SOSCO/RPC14/T1CK/RC14) U4.76(RPD1/SCK1/RD1) U4.80(EBID13/ETXD3/PMD13/RD13) U4.82(*SQICS1/RPD5/RD5) U4.89(TRCLK/SQICLK/RA6) U4.90(TRD3/SQID3/RA7) U4.91(EBID0/PMD0/RE0) U4.94(EBID1/PMD1/RE1) U4.95(TRD2/SQID2/RG14) U4.96(TRD1/SQID1/RG12) U4.97(TRD0/SQID0/RG13) U4.98(EBID2/PMD2/RE2) U$4.12(NC) U$4.13(NC1) U$5.12(NC) U$5.13(NC1)

## Power pins joined to a net without a drawn wire
VBUS: U4.51(VBUS)
VUSB3V3: U4.52(VUSB3V3)

## Library data of the parts
C1-C3 C6-C9 C11-C20 C22-C25 C27-C33 C35-C37 C39-C42 C44-C50 C52-C61 C64-C66 C69 = ASL:CAP: Capacitor Standard 0603 ceramic capacitor, and 0.1" leaded capacitor.
C4 C34 C51 = resistor:CPOL-US: POLARIZED CAPACITOR, American symbol
C5 C10 C21 C26 C38 C43 = ASL:CAP_POL: Capacitor Polarized These are standard SMD and PTH capacitors. Normally 10uF, 47uF, and 100uF in electrolytic and tantalum varieties. Always verify the external diameter of the through hole cap, it varies with capacity, voltage, and manufacturer. The EIA devices should be standard.
C62 C67 = ASL:CAP: Capacitor Standard 0603 ceramic capacitor, and 0.1" leaded capacitor.; VMAX: 100V
C63 C68 = ASL:CAP: Capacitor Standard 0603 ceramic capacitor, and 0.1" leaded capacitor.; VMAX: 16V
CS1-CS3 = 3DOFMDB_COMPONENTS:MAX4376: CURRENT SENSE AMPLIFIER
J1 = ASL:M02: Header 2 Standard 2-pin 0.1" header. Use with straight break away headers (SKU : PRT-00116), right angle break away headers (PRT-00553), swiss pins (PRT-00743), machine pins (PRT-00117), and female headers (PRT-00115). Molex polarized connector foot print use with SKU : PRT-08233 with associated crimp pins and housings.
J2 = ASL:M16: Header 16 Standard 16-pin 0.1" header. Male version: taken from http://search.digikey.com/scripts/DkSearch/dksus.dll?Detail&name=SAM1034-50-ND Female Version:
LED1-LED15 = ASL:LED: LEDs Standard schematic elements and footprints for 5mm, 3mm, 1206, and 0603 sized LEDs. 5mm - Spark Fun Electronics SKU : COM-00529 (and others)
MC MC1 MC2 = con-amp-quick:M08: AMP QUICK CONNECTOR; OC_FARNELL: unknown; OC_NEWARK: unknown
PICKIT PICKIT1-PICKIT3 POWER POWER2 = ASL:M06: Header 6 Standard 6-pin 0.1" header. Use with straight break away headers (SKU : PRT-00116), right angle break away headers (PRT-00553), swiss pins (PRT-00743), machine pins (PRT-00117), and female headers (PRT-00115). Molex polarized connector foot print use with SKU : PRT-08094 with associated crimp pins and housings. NOTES ON THE VARIANTS LOCK and LOCK_LONGPADS... This footprint was designed to help hold the alignment of a through-hole component (i.e. 6-pin header) while soldering it into place. You may notice that each hole has been shifted either up or down by 0.005 of an inch from it's more standard position (which is a perfectly straight line). This slight alteration caused the pins (the squares in the middle) to touch the edges of the holes. Because they are alternating, it causes a "brace" to hold the component in place. 0.005 has proven to be the perfect amount of "off-center" position when using our standard breakaway headers. Although looks a little odd when you look at the bare footprint, once you have a header in there, the alteration is very hard to notice. Also, if you push a header all the way into place, it is covered up entirely on the bottom side. This idea of altering the position of holes to aid alignment will be further integrated into the Sparkfun Library for other footprints. It can help hold any component with 3 or more connection pins.
R1-R45 RSENSE_A RSENSE_A1 RSENSE_A2 RSENSE_B RSENSE_B1 RSENSE_B2 RSENSE_C RSENSE_C1 RSENSE_C2 = ASL:RESISTOR: Resistor Basic schematic elements and footprints for 0603, 1206, and PTH resistors.
SL1 SL2 = ASL:M04: AMP QUICK CONNECTOR
U1-U3 = DRV83x2Support:DRV8312_DDW_44; DATASHEETURL: http://www.ti.com/lit/gpn/DRV8312; DESCRIPTION: 6.5A Three Phase Brushless DC Motor Driver with Inrush Protection (PWM Ctrl); FAMILY_NAME: 3-PHASE BRUSHLESS DRIVER; GENERIC_PART_NUMBER: DRV8312; INDUSTRY_STD_PKG_TYPE: HTSSOP; MANUFACTURER: Texas Instruments; MANUFACTURER_PART_NUMBER: drv8312_ddw_44; PACKAGE_DESIGNATOR: DDW; PIN_COUNT: 44; VENDOR: Texas Instruments
U4 = PIC32_100PIN:PIC32MZXXXXEC(G/H/M)100-I/PT; MANUFACTURER_PART_NUMBER: pic32mz1024ecg100-i/pt; VENDOR: Microchip
U$1-U$3 = DSPIC33:DSPIC33EP512MC502-28SSOP: DSPIC33EP512MC502
U$4 U$5 = drv88xx:DRV8844PWP